# Altium schematic sheet eMMC.SchDoc: eMMC
size 420 x 297 mm; CompanyName: STMicroelectronics; Organization: Microcontrollers Division; DocumentNumber: 6; SheetNumber: 6; SheetTotal: 17
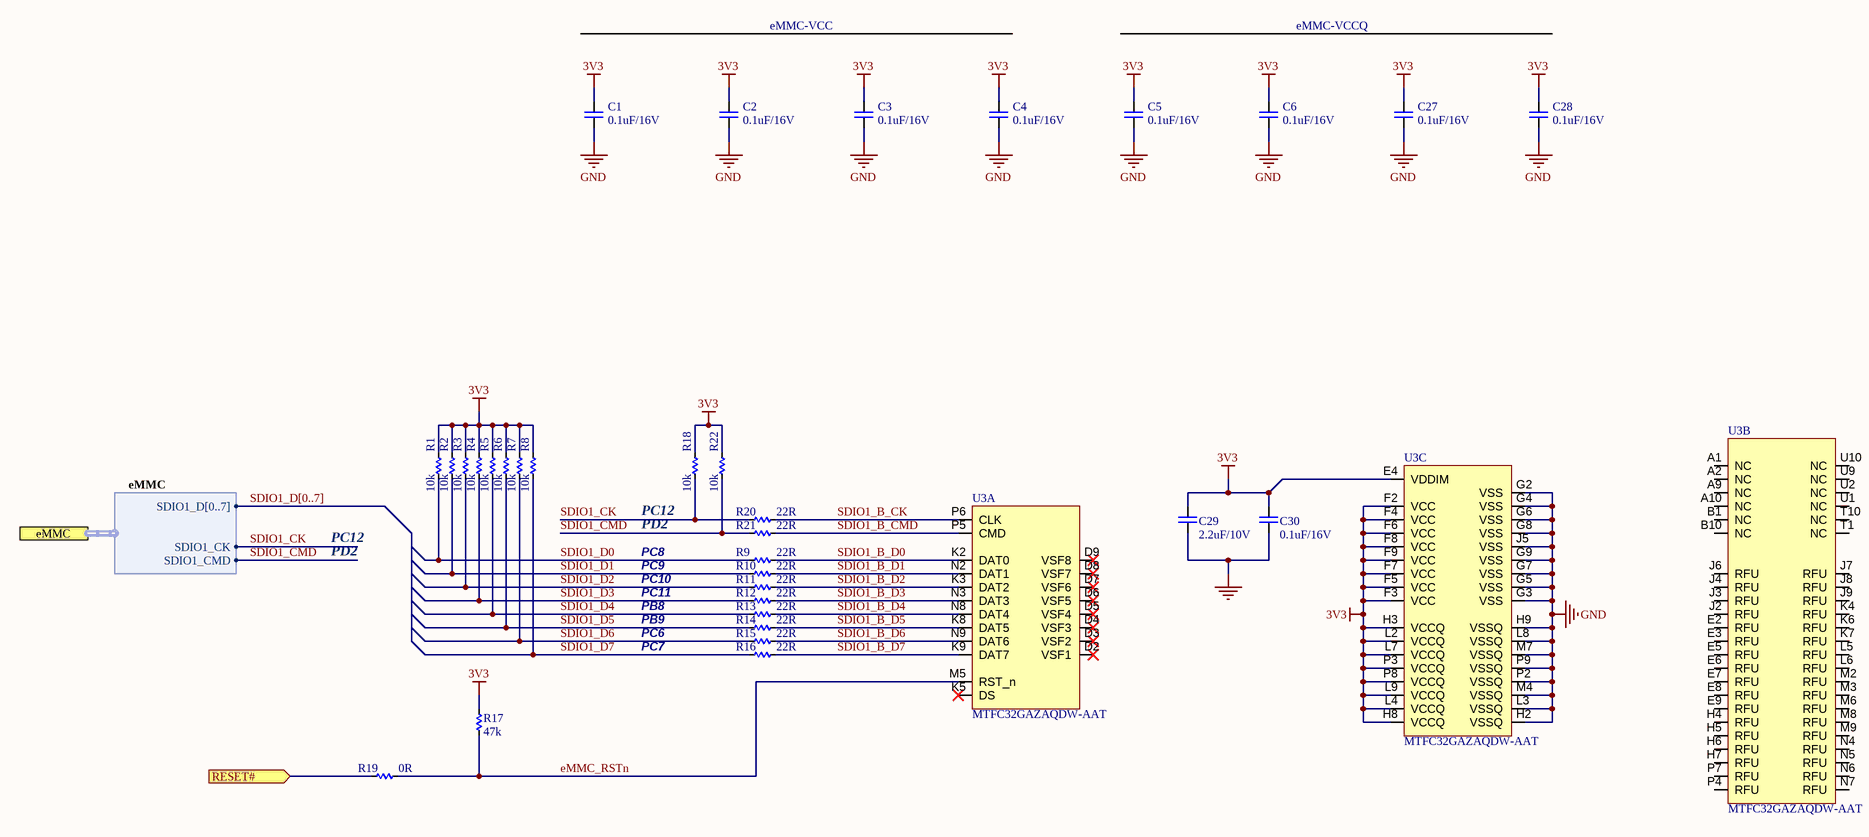
[diagram p0: eMMC.SchDoc]

## Parts
C1  0.1uF/16V  [CAP_C_1608X80]
C2  0.1uF/16V  [CAP_C_1608X80]
C3  0.1uF/16V  [CAP_C_1608X80]
C4  0.1uF/16V  [CAP_C_1608X80]
C5  0.1uF/16V  [CAP_C_1608X80]
C6  0.1uF/16V  [CAP_C_1608X80]
C27  0.1uF/16V  [CAP_C_1608X80]
C28  0.1uF/16V  [CAP_C_1608X80]
C29  2.2uF/10V  [CAP_C_1608X80]
C30  0.1uF/16V  [CAP_C_1608X80]
R1  10k  [RES_C_1608X60]
R2  10k  [RES_C_1608X60]
R3  10k  [RES_C_1608X60]
R4  10k  [RES_C_1608X60]
R5  10k  [RES_C_1608X60]
R6  10k  [RES_C_1608X60]
R7  10k  [RES_C_1608X60]
R8  10k  [RES_C_1608X60]
R9  22R  [RES_C_1608X60]
R10  22R  [RES_C_1608X60]
R11  22R  [RES_C_1608X60]
R12  22R  [RES_C_1608X60]
R13  22R  [RES_C_1608X60]
R14  22R  [RES_C_1608X60]
R15  22R  [RES_C_1608X60]
R16  22R  [RES_C_1608X60]
R17  47k  [RES_C_1608X60]
R18  10k  [RES_C_1608X60]
R19  0R  [RES_C_1608X60]
R20  22R  [RES_C_1608X60]
R21  22R  [RES_C_1608X60]
R22  10k  [RES_C_1608X60]
U3  MTFC32GAZAQDW-AAT  [BGA_100_C_100P_10X17_1400X1800X150]  (parts A,B,C of 3)

## Ports
eMMC (harness eMMC), RESET# (in)

## Harnesses
eMMC: SDIO1_D[0..7], SDIO1_CMD, SDIO1_CK

## Nets
3V3: C1.2 C2.2 C3.2 C4.2 C5.2 C6.2 C27.2 C28.2 C29.2 C30.2 R1.2 R2.2 R3.2 R4.2 R5.2 R6.2 R7.2 R8.2 R17.2 R18.2 R22.2 U3.E4(VDDIM) U3.F2(VCC) U3.F3(VCC) U3.F4(VCC) U3.F5(VCC) U3.F6(VCC) U3.F7(VCC) U3.F8(VCC) U3.F9(VCC) U3.H3(VCCQ) U3.H8(VCCQ) U3.L2(VCCQ) U3.L4(VCCQ) U3.L7(VCCQ) U3.L9(VCCQ) U3.P3(VCCQ) U3.P8(VCCQ)
GND: C1.1 C2.1 C3.1 C4.1 C5.1 C6.1 C27.1 C28.1 C29.1 C30.1 U3.G2(VSS) U3.G3(VSS) U3.G4(VSS) U3.G5(VSS) U3.G6(VSS) U3.G7(VSS) U3.G8(VSS) U3.G9(VSS) U3.H2(VSSQ) U3.H9(VSSQ) U3.J5(VSS) U3.L3(VSSQ) U3.L8(VSSQ) U3.M4(VSSQ) U3.M7(VSSQ) U3.P2(VSSQ) U3.P9(VSSQ)
eMMC_RSTn: R17.1 R19.1 U3.M5(RST_n)
RESET#: R19.2 ; port RESET#
SDIO1_B_CK: R20.2 U3.P6(CLK)
SDIO1_B_CMD: R21.2 U3.P5(CMD)
SDIO1_B_D0: R9.2 U3.K2(DAT0)
SDIO1_B_D1: R10.2 U3.N2(DAT1)
SDIO1_B_D2: R11.2 U3.K3(DAT2)
SDIO1_B_D3: R12.2 U3.N3(DAT3)
SDIO1_B_D4: R13.2 U3.N8(DAT4)
SDIO1_B_D5: R14.2 U3.K8(DAT5)
SDIO1_B_D6: R15.2 U3.N9(DAT6)
SDIO1_B_D7: R16.2 U3.K9(DAT7)
SDIO1_CK: R18.1 R20.1 ; port eMMC.SDIO1_CK
SDIO1_CMD: R21.1 R22.1 ; port eMMC.SDIO1_CMD
SDIO1_D0: R1.1 R9.1
SDIO1_D1: R2.1 R10.1
SDIO1_D2: R3.1 R11.1
SDIO1_D3: R4.1 R12.1
SDIO1_D4: R5.1 R13.1
SDIO1_D5: R6.1 R14.1
SDIO1_D6: R7.1 R15.1
SDIO1_D7: R8.1 R16.1

Not connected (* = marked no-connect by the designer): U3 A1(NC) A2(NC) A9(NC) A10(NC) B1(NC) B10(NC) D2(VSF1)* D3(VSF2)* D4(VSF3)* D5(VSF4)* D6(VSF5)* D7(VSF6)* D8(VSF7)* D9(VSF8)* E2(RFU) E3(RFU) E5(RFU) E6(RFU) E7(RFU) E8(RFU) E9(RFU) H4(RFU) H5(RFU) H6(RFU) H7(RFU) J2(RFU) J3(RFU) J4(RFU) J6(RFU) J7(RFU) J8(RFU) J9(RFU) K4(RFU) K5(DS)* K6(RFU) K7(RFU) L5(RFU) L6(RFU) M2(RFU) M3(RFU) M6(RFU) M8(RFU) M9(RFU) N4(RFU) N5(RFU) N6(RFU) N7(RFU) P4(RFU) P7(RFU) T1(NC) T10(NC) U1(NC) U2(NC) U9(NC) U10(NC)

## Buses and harness runs
bus SDIO1_D[0..7]

## Notes on the sheet
- eMMC-VCC
- eMMC-VCCQ
- PC12
- PD2
- PC8
- PC9
- PC10
- PC11
- PB8
- PC6
- PC7
- PB9
- Project:
- BEE-PC1
- Sub-system:
- NANORACK_EXP_CONTROLLER
- Design by:
- SANG HUYNH
- BAO BUI Q.
- Sheet title:
- Sheet
- A3
- of
- Checked by:
- Approved by:
- VU PHAM
- Revision:
- Document No:
- V1.2.2
- Size:
- Date:

## Library data of the parts
C1-C6 C27-C30 = CAP_SMD: CAP_Chip; Value: 33pF
R1-R22 = _RES_B_2: RES